# Altium schematic sheet 控制板原理图.SchDoc
size A3
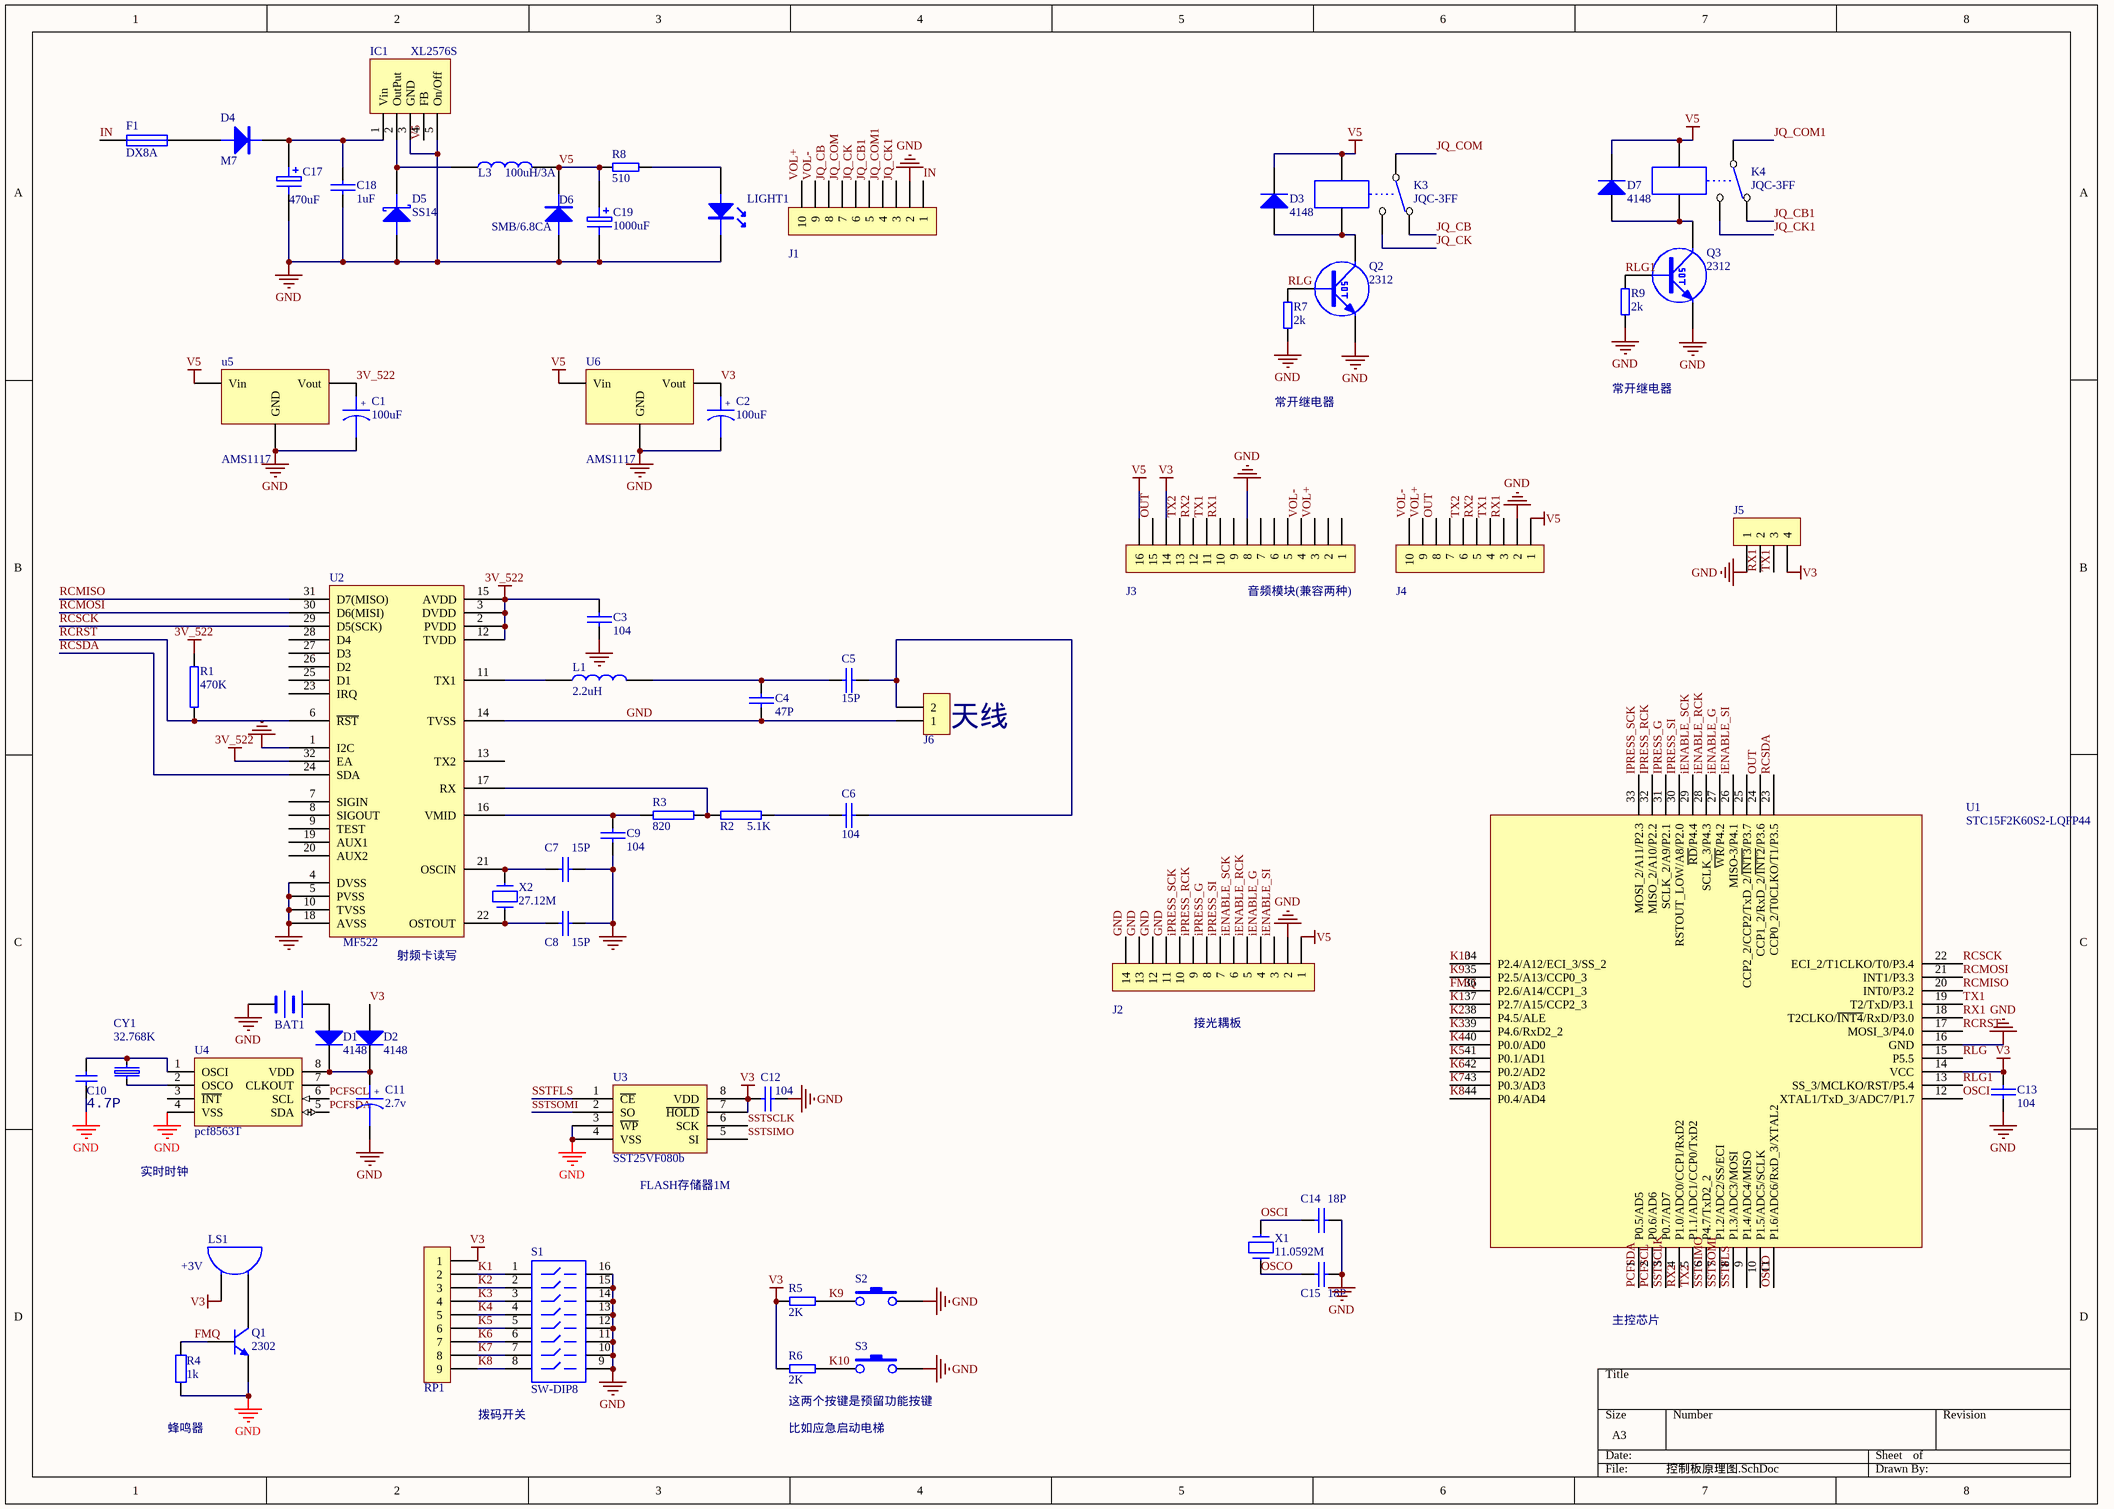
[diagram p0: 控制板原理图.SchDoc]

## Parts
BAT1  BATTERY  [CAP_SCDCS5R5XX4_H]  (value not drawn)
C1  100uF  [SMB]
C2  100uF  [SMB]
C3  104  [0603_C]
C4  47P  [0805]
C5  15P  [0805]
C6  104  [0603_C]
C7  15P  [0603_C]
C8  15P  [0603_C]
C9  104  [0603_C]
C10  4.7P  [0603_C]
C11  2.7v  [YB-CAP_F]
C12  104  [0603_C]
C13  104  [0603_C]
C14  18P  [0603_C]
C15  18P  [0603_C]
C17  470uF  [CAP_RB.2/.52]
C18  1uF  [0603_C]
C19  1000uF  [CAP_RB.2/.52]
CY1  32.768K  [XTAL_26B]
D1  4148  [D_1206]
D2  4148  [D_1206]
D3  4148  [DIODE0.1G_4007]
D4  M7  [D_1812]
D5  SS14  [D_1812]
D6  SMB/6.8CA  [D_1812]
D7  4148  [DIODE0.1G_4007]
F1  DX8A  [7035]
IC1  XL2576S  [TO263-5L]
J1  CON10  [PLUG_DG129_5.08_10P]  (value not drawn)
J2  CON14  [PLUG_PARA14]  (value not drawn)
J3  CON16  [WTW16P]  (value not drawn)
J4  CON10  [SIP10]  (value not drawn)
J5  CON4  [SIP4]  (value not drawn)
J6  CON2  [5.08*5.08]  (value not drawn)
K3  JQC-3FF  [RLY_JQC_3FF_1Z]
K4  JQC-3FF  [RLY_JQC_3FF_1Z]
L1  2.2uH  [SMB]
L3  100uH/3A  [L-5.08]
LIGHT1  LED  [0603_L]  (value not drawn)
LS1  +3V  [FMQ-2]
Q1  2302  [SOT-23]
Q2  2312  [SOT-23]
Q3  2312  [SOT-23]
R1  470K  [0603]
R2  5.1K  [0603]
R3  820  [0603]
R4  1k  [0603]
R5  2K  [0603]
R6  2K  [0603]
R7  2k  [0603]
R8  510  [0603]
R9  2k  [0603]
RP1  2k  [SIP9]  (value not drawn)
S1  SW-DIP8  [DIP16]
S2  SW-PB  [KEY_THT_6_A]  (value not drawn)
S3  SW-PB  [KEY_THT_6_A]  (value not drawn)
U1  STC15F2K60S2-LQFP44  [LQFP-44]
U2  MF522  [MF522]
U3  SST25VF080b  [SOP8-FAT]
U4  pcf8563T  [SO-8]
u5  AMS1117  [SOT-223]
U6  AMS1117  [SOT-223]
X1  11.0592M  [XTAL_HC-49]
X2  27.12M  [XTAL_HC-49]

## Nets
3V_522: C1.1 C3.1 R1.2 U2.2(PVDD) U2.3(DVDD) U2.12(TVDD) U2.15(AVDD) U2.32(EA) u5.2(Vout)
GND: BAT1.2(-) C1.2 C2.2 C3.2 C4.1 C7.2 C8.2 C9.2 C10.2 C11.2 C12.2 C13.2 C14.2 C15.2 C17.2 C18.2 C19.2 D5.A D6.A IC1.3(GND) IC1.5(On/Off) J1.2 J2.2 J2.11 J2.12 J2.13 J2.14 J3.8 J4.2 J5.1 J6.1 LIGHT1.K Q1.2(E) Q2.2(E) Q3.2(E) R4.2 R7.1 R9.1 S1.9 S1.10 S1.11 S1.12 S1.13 S1.14 S1.15 S1.16 S2.2 S3.2 U1.16(GND) U2.1(I2C) U2.4(DVSS) U2.5(PVSS) U2.10(TVSS) U2.14(TVSS) U2.18(AVSS) U3.3(~{WP}) U3.4(VSS) U4.4(VSS) u5.1(GND) U6.1(GND)
V3: C2.1 C12.1 C13.1 D2.1(A) J3.14 J5.4 LS1.1(A) R5.1 R6.1 RP1.1 U1.14(VCC) U3.7(~{HOLD}) U3.8(VDD) U6.2(Vout)
V5: C19.1 D3.K D6.K D7.K IC1.4(FB) J2.1 J3.16 J4.1 K3.4 K4.4 L3.2 R8.1 u5.3(Vin) U6.3(Vin)
FMQ: Q1.1(B) R4.1 U1.36(P2.6/A14/CCP1_3)
iENABLE_G: J2.4 U1.27(~{WR}/P4.2)
iENABLE_RCK: J2.5 U1.28(SCLK_3/P4.3)
iENABLE_SCK: J2.6 U1.29(~{RD}/P4.4)
iENABLE_SI: J2.3 U1.26(MISO-3/P4.1)
IN: F1.1 J1.1
iPRESS_G: J2.8 U1.31(SCLK_2/A9/P2.1)
iPRESS_RCK: J2.9 U1.32(MISO_2/A10/P2.2)
iPRESS_SCK: J2.10 U1.33(MOSI_2/A11/P2.3)
iPRESS_SI: J2.7 U1.30(RSTOUT_LOW/A8/P2.0)
JQ_CB: J1.8 K3.2
JQ_CB1: J1.5 K4.2
JQ_CK: J1.6 K3.3
JQ_CK1: J1.3 K4.3
JQ_COM: J1.7 K3.1
JQ_COM1: J1.4 K4.1
K1: RP1.2 S1.1 U1.37(P2.7/A15/CCP2_3)
K2: RP1.3 S1.2 U1.38(P4.5/ALE)
K3: RP1.4 S1.3 U1.39(P4.6/RxD2_2)
K4: RP1.5 S1.4 U1.40(P0.0/AD0)
K5: RP1.6 S1.5 U1.41(P0.1/AD1)
K6: RP1.7 S1.6 U1.42(P0.2/AD2)
K7: RP1.8 S1.7 U1.43(P0.3/AD3)
K8: RP1.9 S1.8 U1.44(P0.4/AD4)
K9: R5.2 S2.1 U1.35(P2.5/A13/CCP0_3)
K10: R6.2 S3.1 U1.34(P2.4/A12/ECI_3/SS_2)
OSCI: C14.1 U1.12(XTAL1/TxD_3/ADC7/P1.7) X1.2
OSCO: C15.1 U1.11(P1.6/ADC6/RxD_3/XTAL2) X1.1
OUT: J3.15 J4.8 U1.24(CCP1_2/RxD_2/~{INT2}/P3.6)
PCFSCL: U1.2(P0.6/AD6) U4.6(SCL)
PCFSDA: U1.1(P0.5/AD5) U4.5(SDA)
RCMISO: U1.20(INT0/P3.2) U2.31(D7(MISO))
RCMOSI: U1.21(INT1/P3.3) U2.30(D6(MISI))
RCRST: R1.1 U1.17(MOSI_3/P4.0) U2.6(~{RST})
RCSCK: U1.22(ECI_2/T1CLKO/T0/P3.4) U2.29(D5(SCK))
RCSDA: U1.23(CCP0_2/T0CLKO/T1/P3.5) U2.24(SDA)
RLG: Q2.1(B) R7.2 U1.15(P5.5)
RLG1: Q3.1(B) R9.2 U1.13(SS_3/MCLKO/RST/P5.4)
RX1: J3.10 J4.3 J5.2 U1.18(T2CLKO/~{INT4}/RxD/P3.0)
RX2: J3.12 J4.5 U1.4(P1.0/ADC0/CCP1/RxD2)
SSTFLS: U1.8(P1.3/ADC3/MOSI) U3.1(~{CE})
SSTSCLK: U1.3(P0.7/AD7) U3.6(SCK)
SSTSIMO: U1.6(P4.7/TxD2_2) U3.5(SI)
SSTSOMI: U1.7(P1.2/ADC2/SS/ECI) U3.2(SO)
TX1: J3.11 J4.4 J5.3 U1.19(T2/TxD/P3.1)
TX2: J3.13 J4.6 U1.5(P1.1/ADC1/CCP0/TxD2)
VOL+: J1.10 J3.3 J4.9
VOL-: J1.9 J3.4 J4.10
NetBAT1_1: BAT1.1(+) D1.1(A)
NetC4_2: C4.2 C5.2 L1.2
NetC5_1: C5.1 C6.2 J6.2
NetC6_1: C6.1 R2.2
NetC7_1: C7.1 U2.21(OSCIN) X2.2
NetC8_1: C8.1 U2.22(OSTOUT) X2.1
NetC9_1: C9.1 R3.1 U2.16(VMID)
NetC10_1: C10.1 CY1.1 U4.1(OSCI)
NetC11_1: C11.1 D1.2(K) D2.2(K) U4.8(VDD)
NetC17_1: C17.1 C18.1 D4.K IC1.1(Vin)
NetCY1_2: CY1.2 U4.2(OSCO)
NetD3_A: D3.A K3.5 Q2.3(C)
NetD4_A: D4.A F1.2
NetD5_K: D5.K IC1.2(OutPut) L3.1
NetD7_A: D7.A K4.5 Q3.3(C)
NetL1_1: L1.1 U2.11(TX1)
NetLIGHT1_A: LIGHT1.A R8.2
NetLS1_2: LS1.2(B) Q1.3(C)
NetR2_1: R2.1 R3.2 U2.17(RX)

Not connected (* = marked no-connect by the designer): J3 1 2 5 6 7 9; J4 7; U1 9(P1.4/ADC4/MISO) 10(P1.5/ADC5/SCLK) 25(CCP2_2/CCP2/TxD_2/~{INT3}/P3.7); U2 7(SIGIN) 8(SIGOUT) 9(TEST) 13(TX2) 19(AUX1) 20(AUX2) 23(IRQ) 25(D1) 26(D2) 27(D3) 28(D4); U4 3(~{INT}) 7(CLKOUT)

## Notes on the sheet
- 常开继电器
- (near J3) 音频模块(兼容两种)
- (near J6) 天线
- (near U2) 射频卡读写
- 接光耦板
- 实时时钟
- (near U3) FLASH存储器1M
- 主控芯片
- (near R4) 蜂鸣器
- 拨码开关
- 这两个按键是预留功能按键
- 比如应急启动电梯
- (in symbol CAPACITOR POL) +

## Library data of the parts
C1 C2 C11 = CAPACITOR POL: Capacitor
C3-C9 C12-C15 C18 = CAP: Capacitor
C10 = Cap Semi: Capacitor (Semiconductor SIM Model); Manufacturer: Generic Components; Class: Passive; Published: 08/06/2000; Publisher: Altium Hobart Technology Centre; SubClass: Capacitor
C17 C19 = ELECTRO1: Electrolytic Capacitor
CY1 = JZ: Electrolytic Capacitor
D1-D3 D7 = Diode 1N4148: High Conductance Fast Diode; Revision 1: 11-Jul-2000: SIM Model Added.; Revision 2: 17-Jul-2002: Re-released for DXP Platform.; Code - JEDEC: DO-204-AH; Published: 8-Jun-2000; Datasheet: Latest Revision: 1997; Package Reference: DO-35; Publisher: Altium Limited
D4 D6 = DIODE
D5 = DIODE SCHOTTKY: Schottky Diode
F1 = FUSE1: Fuse
J1 J4 = CON10: Connector
J2 = CON14: Connector
J3 = CON16: Connector
J5 = CON4: Connector
J6 = CON2: Connector
K3 K4 = RELAY-SPDT
L1 L3 = INDUCTOR1
LIGHT1 = LED: DIODE_LED_A/B,C
LS1 = Buzzer: Manufacturer: Generic Components; Published: 1999
Q1 = NPN: NPN Bipolar Transistor; Code - JEDEC: TO-226-AA; Published: 8-Jun-2000; Revision: July-2002: Re-released for DXP Platform.; Publisher: Altium Limited
Q2 Q3 = NPN_SOT
R1-R3 = RES2
R4 = Res2: Resistor; Manufacturer: Generic Components; Class: Passive; Published: 08/06/2000; Publisher: Altium Hobart Technology Centre; SubClass: Resistor
R5-R9 = RES5
RP1 = CON9: Connector
U2 = MF522B
U3 = SST25VF020
U4 = HYM8563
u5 U6 = VOLTREG
X1 X2 = Tm08B.S01_12M_42